# EAGLE design try two (EAGLE 7.1.0)
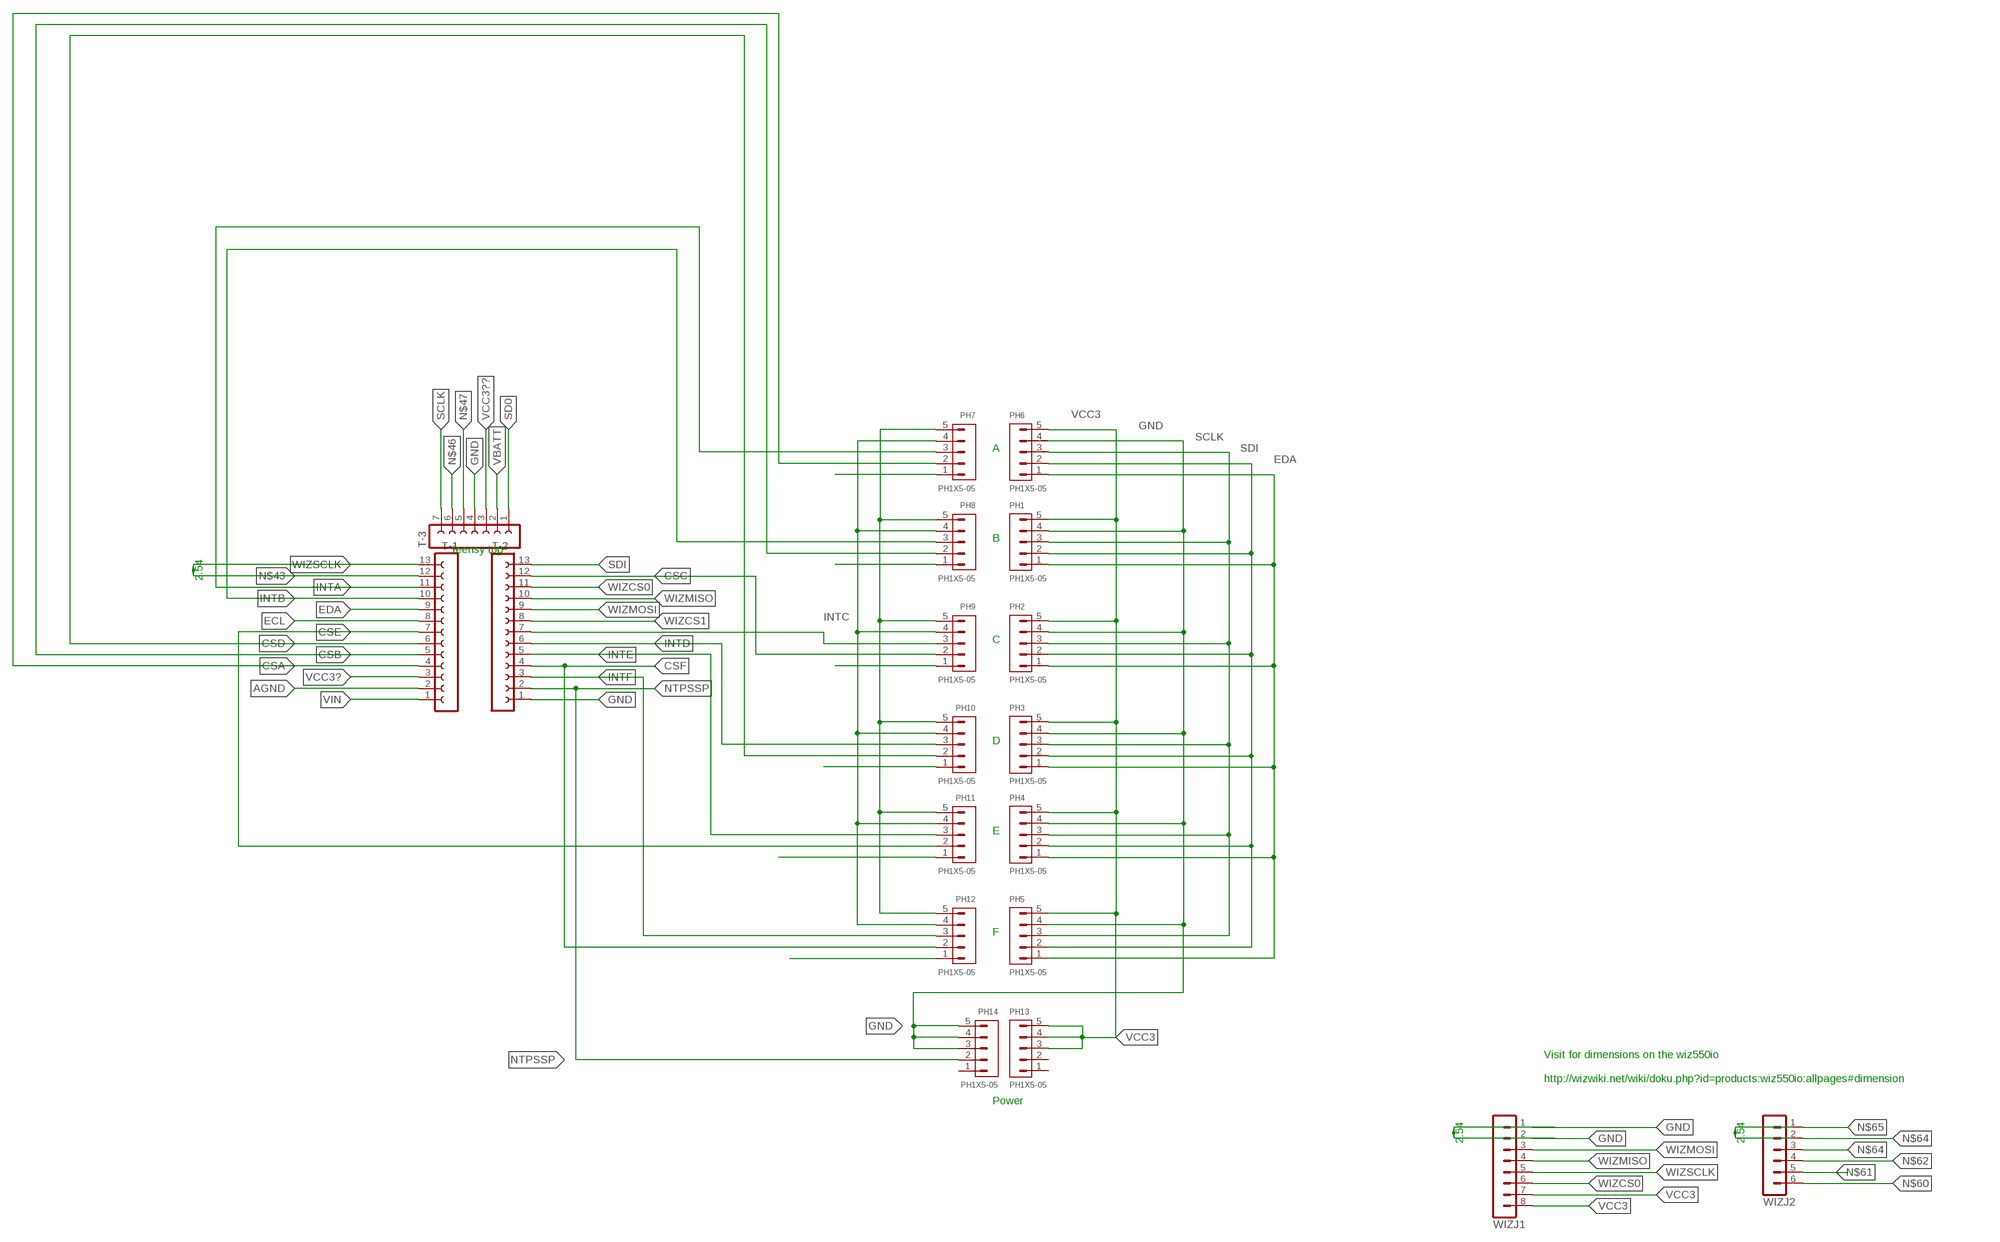
[diagram p0: schematic, sheet 1]

## Parts
PH1  PH1X5-05  [PH005-1-5]
PH2  PH1X5-05  [PH005-1-5]
PH3  PH1X5-05  [PH005-1-5]
PH4  PH1X5-05  [PH005-1-5]
PH5  PH1X5-05  [PH005-1-5]
PH6  PH1X5-05  [PH005-1-5]
PH7  PH1X5-05  [PH005-1-5]
PH8  PH1X5-05  [PH005-1-5]
PH9  PH1X5-05  [PH005-1-5]
PH10  PH1X5-05  [PH005-1-5]
PH11  PH1X5-05  [PH005-1-5]
PH12  PH1X5-05  [PH005-1-5]
PH13  PH1X5-05  [PH005-1-5]
PH14  PH1X5-05  [PH005-1-5]
T-1  FE13-1  [FE13]
T-2  FE13-1  [FE13]
T-3  FE07-1  [FE07]
WIZJ1  MA08-1  [MA08-1]
WIZJ2  MA06-1  [MA06-1]

## Nets
AGND: T-1.2
CSA: PH7.2 T-1.4
CSB: PH8.2 T-1.5
CSC: PH9.2 T-2.12
CSD: PH10.2 T-1.6
CSE: PH11.2 T-1.7
CSF: PH12.2 T-2.4
ECL: PH7.5 PH8.5 PH9.5 PH10.5 PH11.5 PH12.5 T-1.8
EDA: PH1.1 PH2.1 PH3.1 PH4.1 PH5.1 PH6.1 T-1.9
GND: PH1.4 PH2.4 PH3.4 PH4.4 PH5.4 PH6.4 PH14.3 PH14.4 PH14.5 T-2.1 T-3.4 WIZJ1.1 WIZJ1.2
INTA: PH7.3 T-1.11
INTB: PH8.3 T-1.10
INTC: PH9.3 T-2.7
INTD: PH10.3 T-2.6
INTE: PH11.3 T-2.5
INTF: PH12.3 T-2.3
N$1: PH7.1
N$3: PH11.1
N$6: PH12.1
N$7: PH10.1
N$12: PH9.1
N$13: PH8.1
N$43: T-1.12
N$46: T-3.6
N$47: T-3.5
N$60: WIZJ2.6
N$61: WIZJ2.5
N$62: WIZJ2.4
N$63: WIZJ2.3
N$64: WIZJ2.2
N$65: WIZJ2.1
NTPSSP: PH14.2 T-2.2
SCLK: PH1.3 PH2.3 PH3.3 PH4.3 PH5.3 PH6.3 T-3.7
SD0: PH7.4 PH8.4 PH9.4 PH10.4 PH11.4 PH12.4 T-3.1
SDI: PH1.2 PH2.2 PH3.2 PH4.2 PH5.2 PH6.2 T-2.13
VBATT: T-3.2
VCC3: PH1.5 PH2.5 PH3.5 PH4.5 PH5.5 PH6.5 PH13.3 PH13.4 PH13.5 WIZJ1.7 WIZJ1.8
VCC3?: T-1.3
VCC3??: T-3.3
VIN: T-1.1
WIZCS0: T-2.11 WIZJ1.6
WIZCS1: T-2.8
WIZMISO: T-2.10 WIZJ1.4
WIZMOSI: T-2.9 WIZJ1.3
WIZSCLK: T-1.13 WIZJ1.5
Unconnected: PH13.1 PH13.2 PH14.1

## Notes on the sheet
- A
- B
- teensy top
- C
- D
- E
- F
- Visit for dimensions on the wiz550io
  
  http://wizwiki.net/wiki/doku.php?id=products:wiz550io:allpages#dimension
- Power

## Library data of the parts
PH1-PH14 = pel_hdr:PH1X5
T-1 T-2 = con-lsta:FE13-1: FEMALE HEADER; OC_FARNELL: unknown; OC_NEWARK: unknown
T-3 = con-lsta:FE07-1: FEMALE HEADER; OC_FARNELL: unknown; OC_NEWARK: unknown
WIZJ1 = con-lstb:MA08-1: PIN HEADER; OC_FARNELL: unknown; OC_NEWARK: unknown
WIZJ2 = con-lstb:MA06-1: PIN HEADER; OC_FARNELL: unknown; OC_NEWARK: unknown

## Board
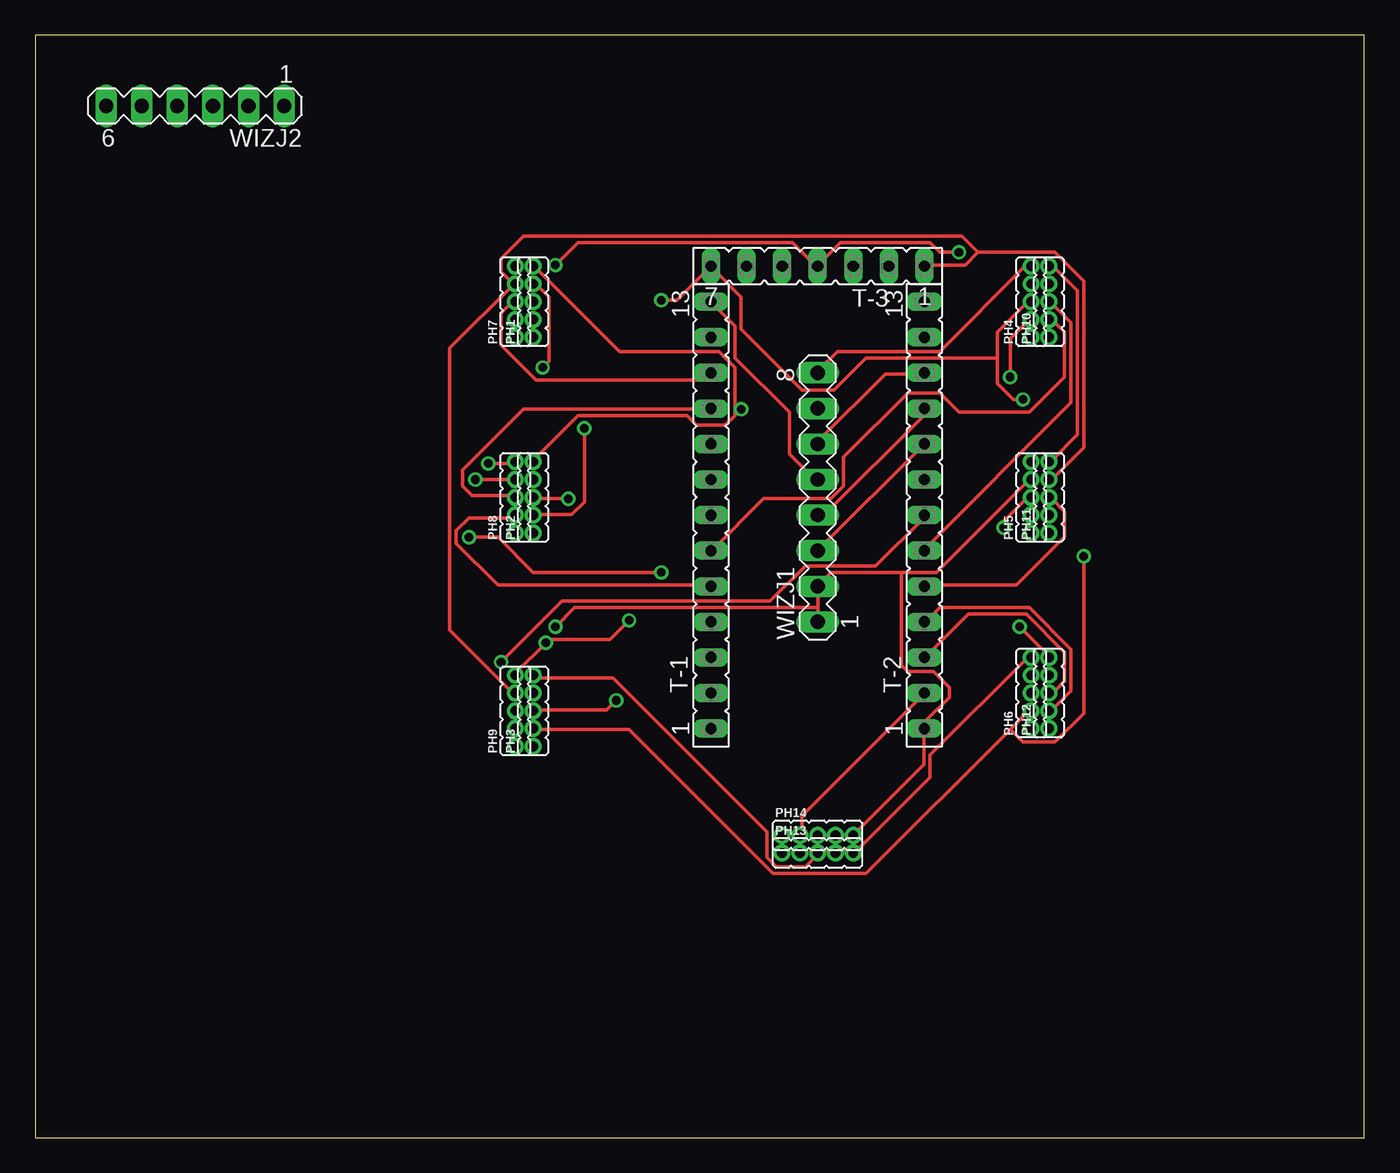
[diagram p1: board, top side]
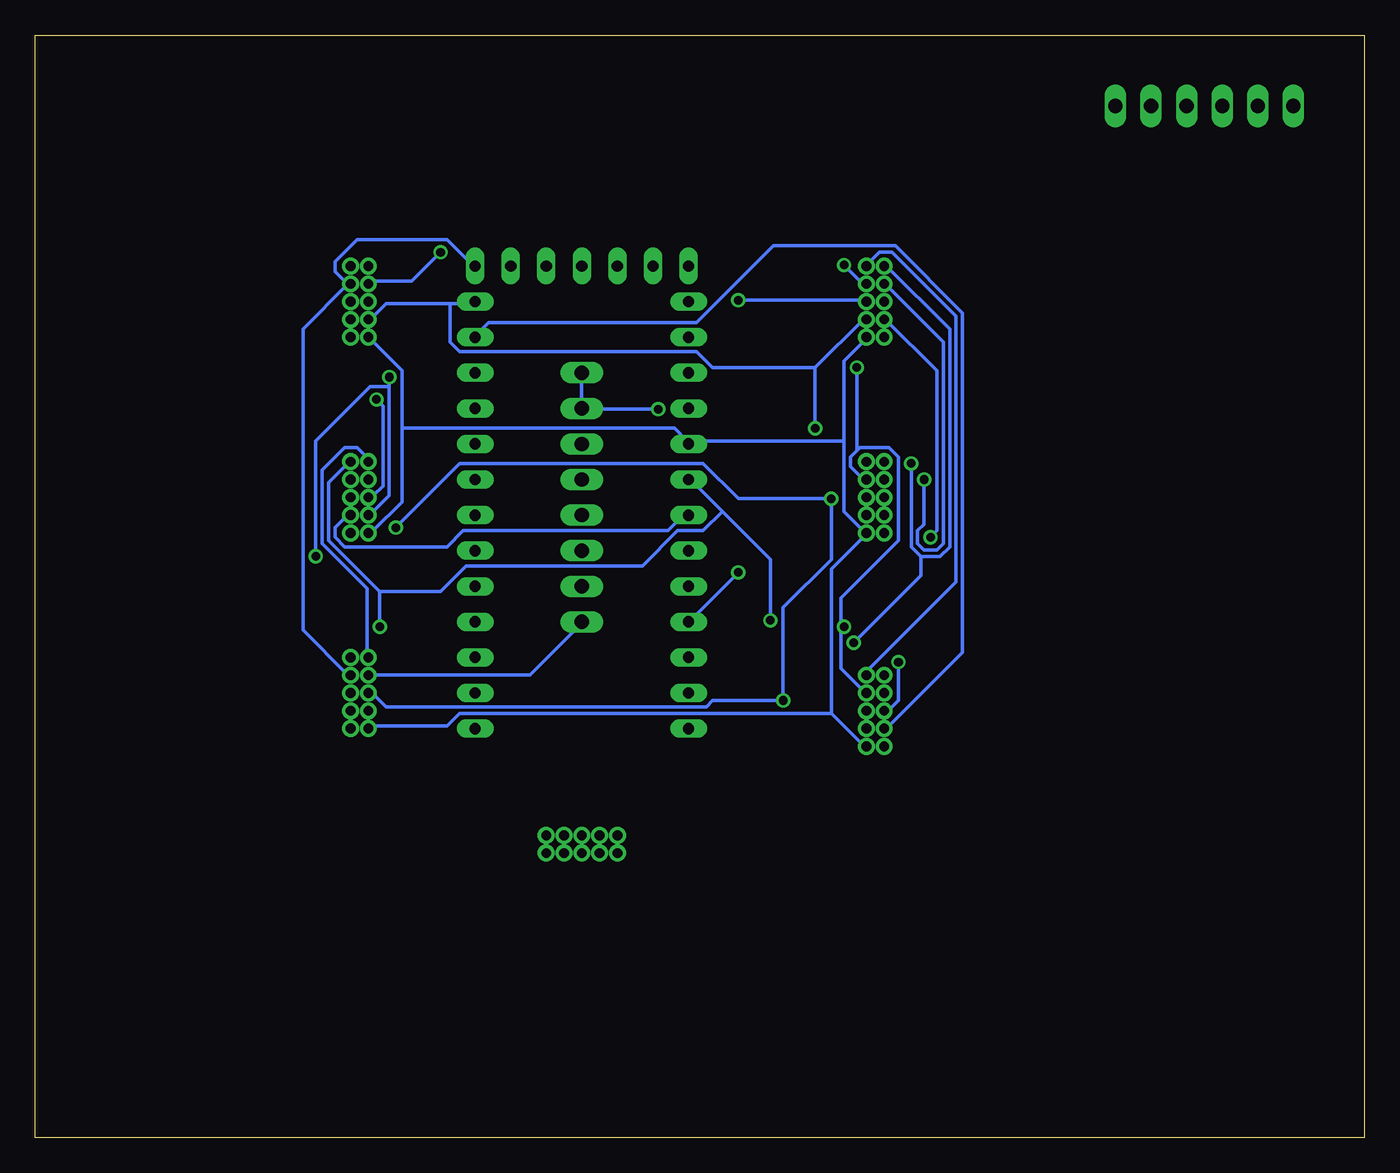
[diagram p2: board, bottom side, seen from below]

Size 94.92 x 78.73 mm. Coordinates in mm from the lower left corner, seen from the top.
Outline: 0,0 94.92,0 94.92,78.73 0,78.73 0,0
Copper layers (1*16): Top 0.035mm / dielectric 1.5mm / Bottom 0.035mm
Design rules "default": minimum track width 10mil, minimum drill 24mil, track to track 8mil, track to pad 8mil, pad to pad 8mil, via to via 8mil, smd to smd 8mil, copper to edge 40mil, drill to drill 8mil, minimum pad ring 10mil, minimum via ring 8mil, stop-mask expansion 4mil, vias tented up to drill 0mil, thermal gap 10mil

### Footprints (pad centres in the part's own frame; a part is rotated, then mirrored left to right if it is on the bottom)
PH005-1-5 = drill 0.7 pad 1.016: 1 0,0; 2 1.27,0; 3 2.54,0; 4 3.81,0; 5 5.08,0
FE13 = drill 0.813 long: 1 -15.24,0; 2 -12.7,0; 3 -10.16,0; 4 -7.62,0; 5 -5.08,0; 6 -2.54,0; 7 0,0; 8 2.54,0; 9 5.08,0; 10 7.62,0; 11 10.16,0; 12 12.7,0; 13 15.24,0
FE07 = drill 0.813 long: 1 -7.62,0; 2 -5.08,0; 3 -2.54,0; 4 0,0; 5 2.54,0; 6 5.08,0; 7 7.62,0
MA08-1 = drill 1.016 long: 1 -8.89,0; 2 -6.35,0; 3 -3.81,0; 4 -1.27,0; 5 1.27,0; 6 3.81,0; 7 6.35,0; 8 8.89,0
MA06-1 = drill 1.016 long: 1 -6.35,0; 2 -3.81,0; 3 -1.27,0; 4 1.27,0; 5 3.81,0; 6 6.35,0

### Placement (x,y rotation side)
PH1  35.56,57.15 90 top
PH2  35.56,43.18 90 top
PH3  35.56,27.94 90 top
PH4  71.12,57.15 90 top
PH5  71.12,43.18 90 top
PH6  71.12,29.21 90 top
PH7  34.29,57.15 90 top
PH8  34.29,43.18 90 top
PH9  34.29,27.94 90 top
PH10  72.39,57.15 90 top
PH11  72.39,43.18 90 top
PH12  72.39,29.21 90 top
PH13  53.34,20.32 0 top
PH14  53.34,21.59 0 top
T-1  48.26,44.45 90 top
T-2  63.5,44.45 90 top
T-3  55.88,62.23 180 top
WIZJ1  55.88,45.72 90 top
WIZJ2  11.43,73.66 180 top

### Tracks (layer width: path | path; a pad name or v marks a point on that pad's centre or on a via)
CSA  (via drill 0.61)
  Top 0.254: v30.99,42.88 33.05,42.88 35.56,40.36 v44.7,40.36
  Bottom 0.254: v30.99,42.88 30.53,43.33 30.53,54.76 34.19,58.42 PH7.2 | v44.7,40.36 48.13,36.93 T-1.4
CSB
  Top 0.254: PH8.2 34.19,44.25 30.99,44.25 30.07,43.33 30.07,42.42 33.05,39.45 48.13,39.45 T-1.5
CSC
  Bottom 0.254: PH9.2 34.19,29.39 33.96,29.39 28.7,34.65 28.7,58.88 33.5,63.68 42.19,63.68 47.68,58.19 62.54,58.19 63.45,57.28 T-2.12
CSD
  Top 0.254: PH10.2 72.59,58.42 73.51,57.51 73.51,54.3 70.99,51.79 65.96,51.79 64.59,53.16 62.31,53.16 57.73,48.59 57.73,46.53 56.82,45.62 52.02,45.62 48.36,41.96 T-1.6
CSE
  Bottom 0.254: PH11.2 72.59,44.25 72.82,44.25 73.51,43.56 73.51,42.88 72.82,42.19 65.51,42.19 64.36,43.33 49.73,43.33 48.82,44.25 48.36,44.25 T-1.7
CSF
  Top 0.254: PH12.2 72.59,30.53 73.96,31.9 73.96,34.87 70.99,37.85 64.59,37.85 63.68,36.93 T-2.4
ECL  (via drill 0.61)
  Top 0.254: v70.31,36.47 72.36,34.42 PH12.5 | PH10.5 72.59,62.08 72.82,62.08 74.42,60.48 74.42,50.19 72.59,48.36 PH11.5 | v32.36,48.13 34.19,48.13 PH8.5 | v42.42,36.93 41.05,35.56 36.7,35.56 v36.47,35.33 34.42,33.27 34.42,33.05 PH9.5
  Bottom 0.254: 70.31,38.99 v70.31,36.47 | 70.31,38.99 73.96,42.65 73.96,46.76 72.59,48.13 PH11.5 | v32.36,48.13 32.36,42.19 31.67,41.5 | 31.67,41.5 30.3,41.5 29.62,42.19 29.62,57.73 34.19,62.31 PH7.5 | v42.42,36.93 42.42,41.28 45.85,44.7 | 45.85,44.7 48.13,46.99 T-1.8 | 31.67,41.5 31.67,40.13 v36.47,35.33 | 70.31,38.99 65.96,38.99 64.14,40.82 51.56,40.82 49.05,43.33 47.22,43.33 45.85,44.7
EDA
  Bottom 0.254: 68.71,50.65 68.71,54.76 70.99,57.05 PH4.1 | 68.71,50.65 68.71,45.39 70.76,43.33 70.99,43.33 PH5.1 | 38.08,30.3 35.79,28.02 35.56,28.02 PH3.1 | 38.08,30.3 38.08,40.59 35.56,43.1 | 38.08,30.3 64.59,30.3 65.51,29.39 70.99,29.39 PH6.1 | 37.16,49.73 37.16,44.7 35.56,43.1 | 37.16,49.73 37.16,55.45 35.56,57.05 PH1.1 | 35.56,43.1 PH2.1 | 37.16,49.73 48.13,49.73 T-1.9 48.36,49.73 49.28,50.65 68.71,50.65
GND  (via drill 0.61)
  Top 0.254: PH14.3 55.91,21.61 57.05,21.61 PH14.4 57.28,21.61 58.42,21.61 | 58.42,21.61 63.45,26.64 63.45,29.16 T-2.1 63.68,29.39 63.68,29.84 65.28,31.45 65.28,32.13 64.14,33.27 62.31,33.27 61.85,33.73 61.85,40.36 | 58.42,21.61 PH14.5 | 61.85,40.36 56.82,40.36 55.91,39.45 WIZJ1.2 55.91,39.22 55.91,37.85 | 61.85,40.36 64.36,40.36 70.99,46.99 PH5.4 | 55.91,37.85 55.91,36.93 WIZJ1.1 | v65.96,63.22 64.59,63.22 63.91,63.91 57.51,63.91 55.91,62.31 T-3.4 55.68,62.31 54.08,63.91 38.76,63.91 v37.16,62.31 | v36.25,54.99 36.7,55.45 36.7,60.02 35.79,60.94 35.56,60.94 PH1.4 | 55.91,37.85 38.53,37.85 v37.16,36.47
  Bottom 0.254: PH6.4 70.99,33.05 59.56,33.05 55.91,36.7 WIZJ1.1 | v65.96,63.22 68.02,61.16 70.99,61.16 PH4.4 | 37.39,36.47 37.39,38.53 33.27,42.65 33.27,48.59 33.96,49.28 36.02,49.28 36.25,49.05 | 37.39,36.47 37.39,33.5 35.79,31.9 35.56,31.9 PH3.4 | 36.25,49.05 36.7,48.59 36.7,47.9 35.79,46.99 PH2.4 | 36.25,49.05 v36.25,54.99 | v37.16,62.31 36.02,61.16 35.56,61.16 PH1.4 | 37.39,36.47 v37.16,36.47
INTA
  Top 0.254: PH7.3 34.19,59.56 33.96,59.56 33.27,58.88 33.27,56.59 35.79,54.08 47.68,54.08 48.13,54.53 T-1.11
INTB
  Top 0.254: PH8.3 34.19,45.85 31.22,45.85 30.53,46.53 30.53,47.68 34.87,52.02 48.13,52.02 T-1.10
INTC  (via drill 0.61)
  Top 0.254: v33.27,33.96 37.62,38.3 52.48,38.3 54.99,40.82 60.02,40.82 63.45,44.25 T-2.7
  Bottom 0.254: v33.27,33.96 33.27,31.22 33.96,30.53 34.19,30.53 PH9.3
INTD
  Top 0.254: PH10.3 72.59,59.56 73.96,58.19 73.96,52.48 63.45,41.96 T-2.6
INTE
  Top 0.254: PH11.3 72.59,45.62 73.51,44.7 73.51,42.88 70.08,39.45 63.68,39.45 T-2.5
INTF
  Top 0.254: PH12.3 72.59,31.9 72.82,31.9 73.51,32.59 73.51,34.65 70.76,37.39 66.65,37.39 63.68,34.42 T-2.3
NTPSSP
  Top 0.254: PH14.2 54.76,21.61 54.76,22.99 63.45,31.67 T-2.2
SCLK  (via drill 0.61)
  Top 0.254: v41.5,31.22 40.82,30.53 35.56,30.53 PH3.3 | v38.08,45.62 35.56,45.62 PH2.3 | v70.54,52.71 69.85,52.71 68.71,53.85 68.71,55.68 | 68.71,55.68 68.71,57.51 70.99,59.79 PH4.3 | v44.7,59.79 45.85,59.79 48.13,62.08 T-3.7 48.36,62.08 50.42,60.02 50.42,57.73 54.76,53.39 57.05,53.39 59.33,55.68 68.71,55.68 | v69.16,43.56 69.16,44.02 70.99,45.85 PH5.3
  Bottom 0.254: PH6.3 70.99,31.9 69.85,30.76 46.99,30.76 46.53,31.22 v41.5,31.22 41.5,37.85 38.08,41.28 v38.08,45.62 44.7,45.62 47.22,48.13 64.59,48.13 v69.16,43.56 | v70.54,52.71 70.08,52.25 70.08,46.53 70.76,45.85 70.99,45.85 PH5.3 | v44.7,59.79 35.56,59.79 PH1.3
SD0  (via drill 0.61)
  Top 0.254: PH9.4 34.19,31.9 33.96,31.9 29.62,36.25 29.62,56.36 34.19,60.94 PH7.4 34.19,61.16 33.96,61.16 33.27,61.85 33.27,62.76 34.87,64.36 66.19,64.36 67.33,63.22 | v31.45,46.99 PH8.4 | 67.33,63.22 72.82,63.22 74.88,61.16 74.88,49.28 72.59,46.99 PH11.4 | 67.33,63.22 66.42,62.31 63.68,62.31 T-3.1
  Bottom 0.254: v31.45,46.99 31.45,43.79 31.9,43.33 31.9,42.42 31.45,41.96 30.53,41.96 30.07,42.42 30.07,56.82 34.19,60.94 PH7.4 | 72.59,60.94 75.79,57.73 75.79,36.25 72.59,33.05 PH12.4 | 72.59,60.94 73.51,61.85 73.51,62.54 71.91,64.14 65.51,64.14 63.68,62.31 T-3.1 | 72.59,60.94 PH10.4
SDI  (via drill 0.61)
  Top 0.254: 69.62,29.16 70.99,30.53 PH6.2 | 69.62,29.16 59.33,18.87 52.71,18.87 42.42,29.16 35.56,29.16 PH3.2 | v39.22,50.65 39.22,45.39 38.3,44.48 35.56,44.48 PH2.2 | v69.62,54.3 69.62,57.05 70.99,58.42 PH4.2 | 69.62,29.16 70.54,28.25 72.82,28.25 74.88,30.3 v74.88,41.5
  Bottom 0.254: 39.22,54.99 v39.22,50.65 | 39.22,54.99 35.79,58.42 PH1.2 | v69.62,54.3 69.62,53.62 | 69.62,53.62 69.62,45.85 70.99,44.48 PH5.2 | 65.28,59.56 69.85,59.56 70.99,58.42 PH4.2 | 65.28,59.56 63.68,59.56 T-2.13 | 39.22,54.99 46.53,54.99 47.68,56.13 64.59,56.13 65.28,56.82 65.28,59.56 | v74.88,41.5 74.88,49.73 70.99,53.62 69.62,53.62
VCC3  (via drill 0.61)
  Top 0.254: PH4.5 70.99,62.08 70.54,62.08 64.59,56.13 57.28,56.13 55.91,54.76 WIZJ1.8 | 49.96,52.02 49.96,54.99 48.82,56.13 41.73,56.13 35.56,62.31 PH1.5 | 49.96,52.02 49.96,51.56 49.28,50.88 47.22,50.88 46.53,51.56 38.76,51.56 35.56,48.36 PH2.5 | 49.96,52.02 v50.42,52.02 | PH3.5 35.56,32.82 41.28,32.82 52.25,21.84 52.25,20.02 52.93,19.33 54.99,19.33 55.91,20.24 PH13.3 55.91,20.47 57.05,20.47 PH13.4 57.28,20.47 58.42,20.47 PH13.5 58.42,20.24 63.91,25.73 63.91,27.33 70.76,34.19 70.99,34.19 PH6.5
  Bottom 0.254: WIZJ1.8 55.91,54.53 55.91,52.25 WIZJ1.7 55.68,52.02 v50.42,52.02 | PH6.5 71.22,34.42 71.22,39.22 74.42,42.42 74.42,47.68 72.82,49.28 71.91,49.28 70.99,48.36 PH5.5 | PH3.5 35.56,33.27 29.16,39.68 29.16,58.65 33.73,63.22 34.65,63.22 35.56,62.31 PH1.5
WIZCS0
  Top 0.254: T-2.11 63.45,54.53 60.71,54.53 55.91,49.73 WIZJ1.6
WIZMISO
  Top 0.254: T-2.10 63.45,52.02 63.45,51.56 56.36,44.48 55.91,44.48 WIZJ1.4
WIZMOSI
  Top 0.254: T-2.9 63.45,49.51 55.91,41.96 WIZJ1.3
WIZSCLK
  Top 0.254: T-1.13 48.36,59.56 49.96,57.96 49.96,55.68 53.85,51.79 53.85,48.82 55.68,46.99 WIZJ1.5